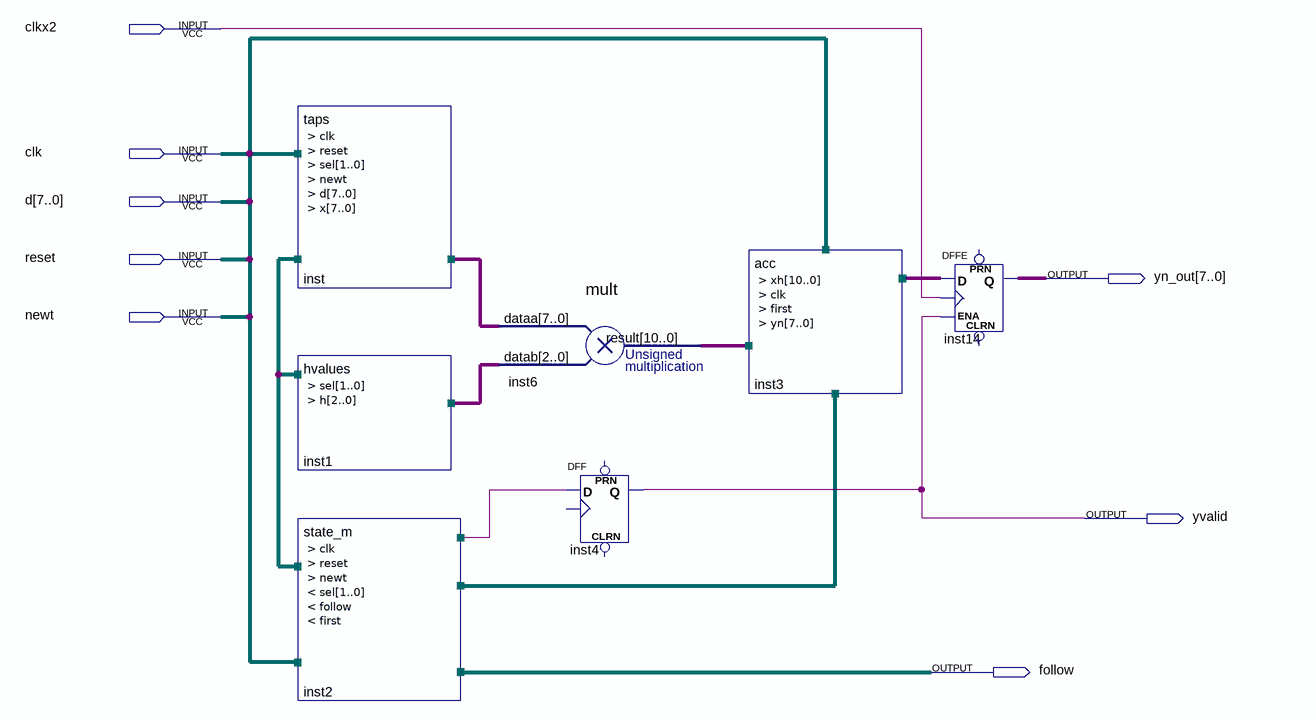
[diagram p0: schematic sheet]
// Quartus schematic fir_filter.bdf as structural Verilog: 7 symbols, 8 pins
module fir_filter (
  input  clkx2,
  input  clk,
  input  [7:0] d,
  input  reset,
  input  newt,
  output [7:0] yn_out,
  output yvalid,
  output follow
);

  wire first, undriven_4;
  wire [1:0] sel;
  wire [2:0] undriven_2;
  wire [7:0] undriven, undriven_3;
  wire [10:0] inst6_result;

  taps inst (.clk(clk), .reset(reset), .sel(sel), .newt(newt), .d(d));  // open: x
  hvalues inst1 (.sel(sel));  // open: h
  state_m inst2 (.clk(clk), .reset(reset), .newt(newt), .sel(sel), .follow(follow), .first(first));
  mult inst6 (.dataa(undriven), .datab(undriven_2), .result(inst6_result));
  DFF inst4 (.D(undriven_4), .Q(yvalid));  // open: CLRN, CLK, PRN
  acc inst3 (.clk(clk), .first(first));  // open: xh, yn
  DFFE inst14[7:0] (.D(undriven_3), .CLK(clkx2), .ENA(yvalid), .Q(yn_out));  // open: PRN, CLRN
endmodule
